# Altium schematic sheet pageb.SchDoc
size 381 x 241 mm
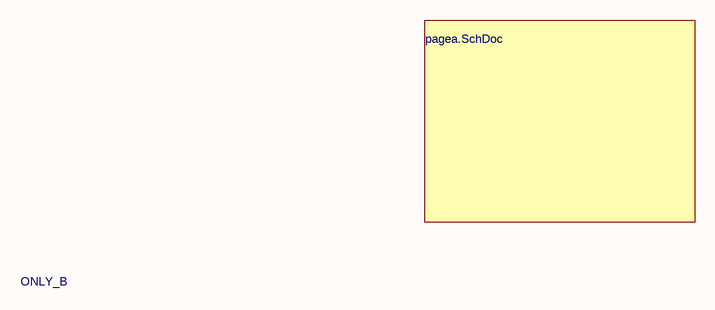
[diagram p0: pageb.SchDoc]

## Sub-sheets
? = pagea.SchDoc: no entries

## Notes on the sheet
- Labels drawn without touching a wire or pin: ONLY_B